# Altium schematic sheet AIM2 - FTDI REVB.SchDoc: FTDI USB to UART Interface
size B; DrawnBy: DJW; DocumentNumber: 4; SheetNumber: 4; SheetTotal: 12
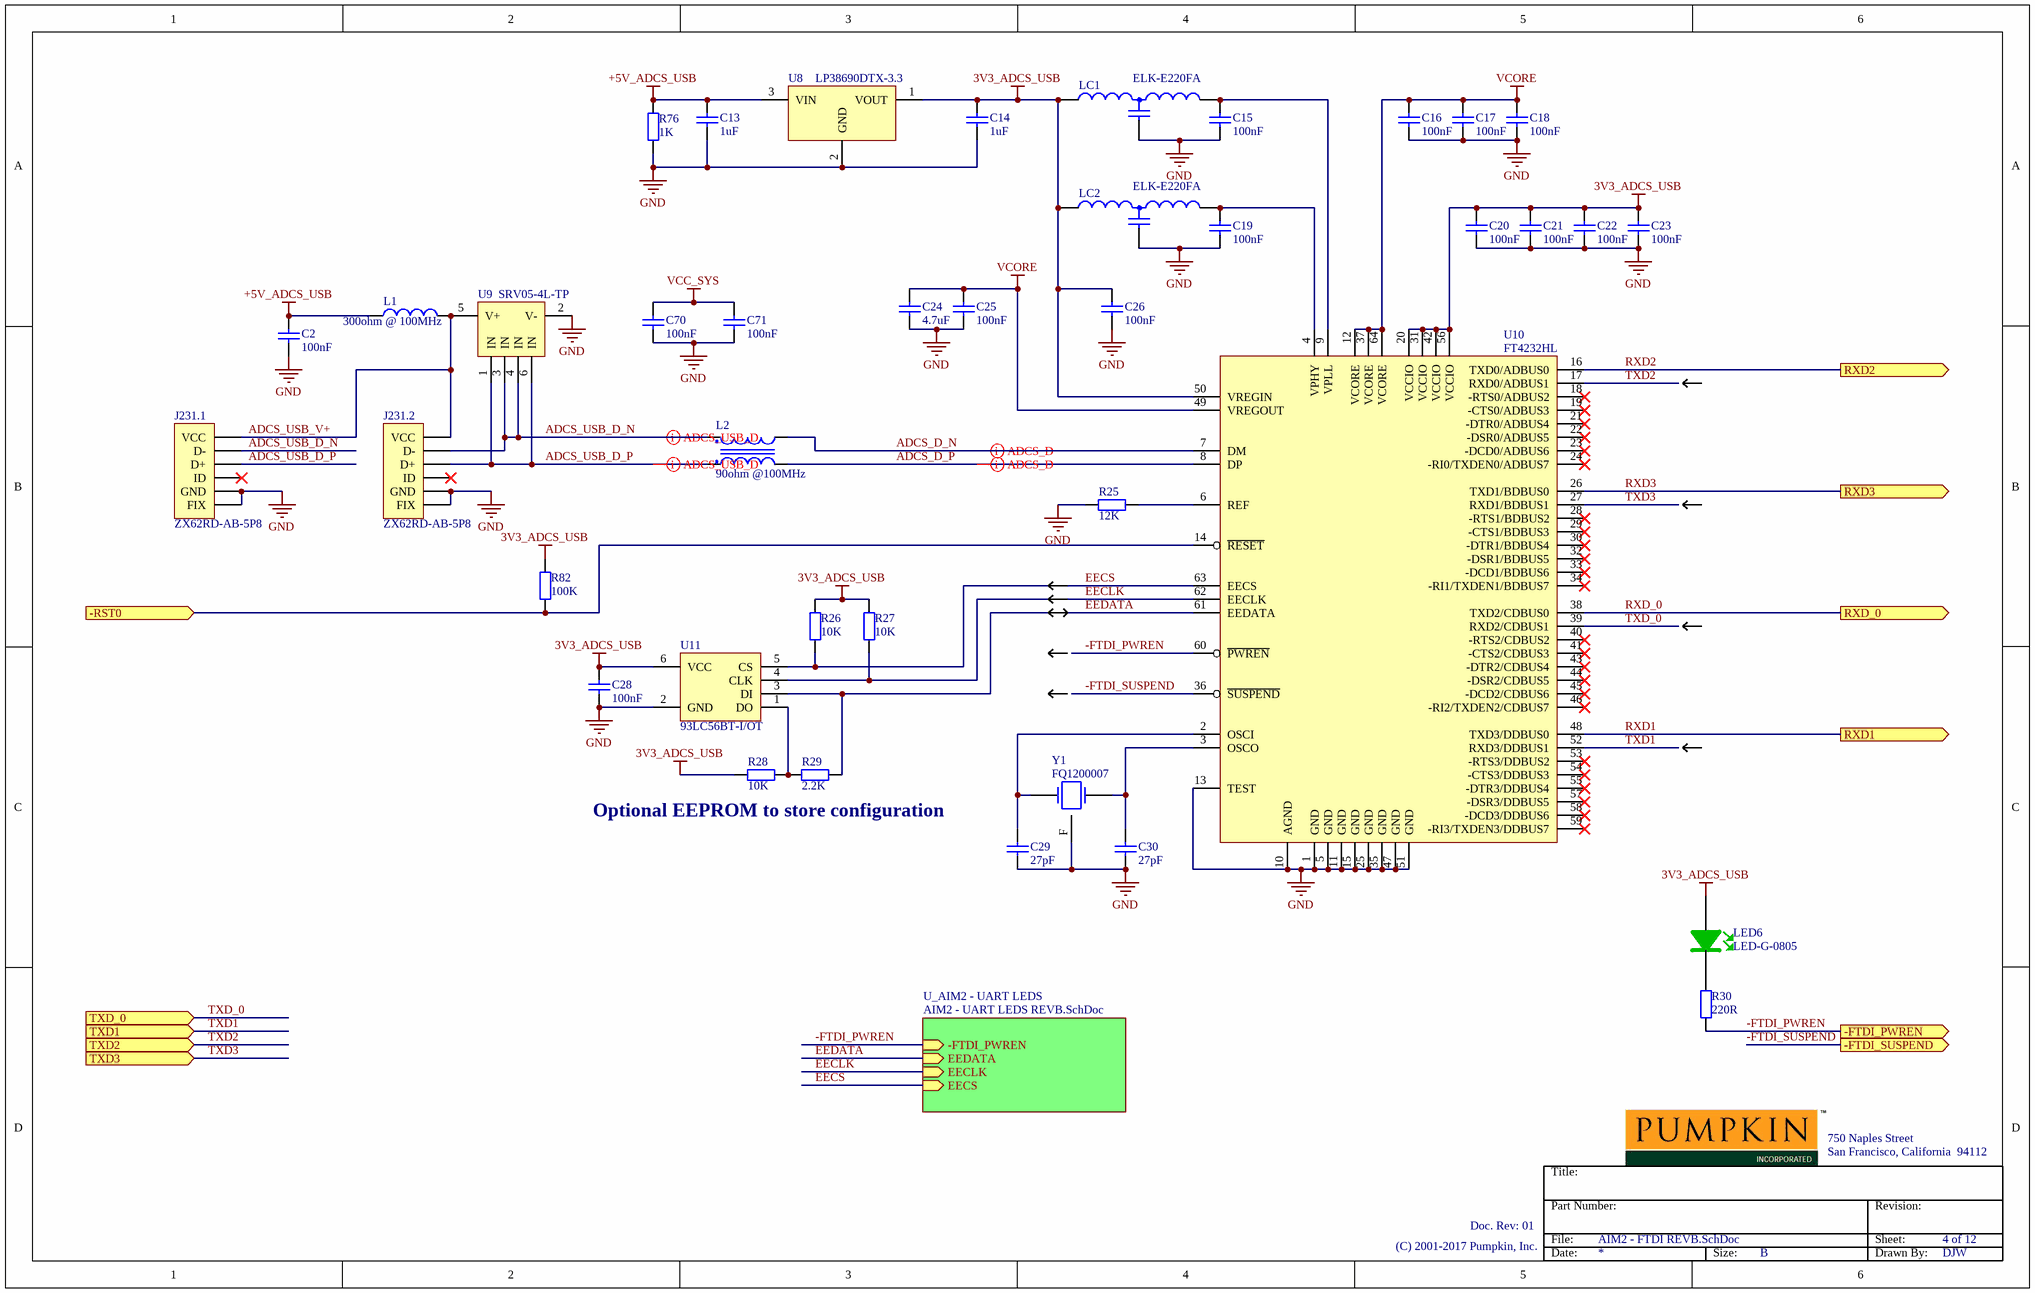
[diagram p0: AIM2 - FTDI REVB.SchDoc]

## Parts
C2  100nF  [0603 CAP]
C13  1uF  [0805 CAP]
C14  1uF  [0805 CAP]
C15  100nF  [0603 CAP]
C16  100nF  [0603 CAP]
C17  100nF  [0603 CAP]
C18  100nF  [0603 CAP]
C19  100nF  [0603 CAP]
C20  100nF  [0603 CAP]
C21  100nF  [0603 CAP]
C22  100nF  [0603 CAP]
C23  100nF  [0603 CAP]
C24  4.7uF  [0805 CAP]
C25  100nF  [0603 CAP]
C26  100nF  [0603 CAP]
C28  100nF  [0603 CAP]
C29  27pF  [0402 CAP]
C30  27pF  [0402 CAP]
C70  100nF  [0603 CAP]
C71  100nF  [0603 CAP]
J231.1  ZX62RD-AB-5P8  [SM$5C$ZX62RD-AB-5P8]
J231.2  ZX62RD-AB-5P8  [SM$5C$ZX62RD-AB-5P8]
L1  300ohm @ 100MHz  [0603 IND]
L2  90ohm @100MHz  [DFN250P320X200-4N]
LC1  ELK-E220FA  [ELK]
LC2  ELK-E220FA  [ELK]
LED6  LED-G-0805  [0805 LED-GREEN]
R25  12K  [0603 RES]
R26  10K  [0805 RES]
R27  10K  [0805 RES]
R28  10K  [0805 RES]
R29  2.2K  [0805 RES]
R30  220R  [0805 RES]
R76  1K  [0805 RES]
R82  100K  [0805 RES]
U8  LP38690DTX-3.3  [DPAK]
U9  SRV05-4L-TP  [SOT23-6]
U10  FT4232HL  [TSQFP50P1200X1200X120_HS-65N]
U11  93LC56BT-I/OT  [SOT23-6]
Y1  FQ1200007  [FQ Crystal]

## Sub-sheets
U_AIM2 - UART LEDS = AIM2 - UART LEDS REVB.SchDoc: -FTDI_PWREN (in), EEDATA (in), EECLK (in), EECS (in)

## Ports
-FTDI_PWREN (out), -FTDI_SUSPEND (out), -RST0 (in), RXD1 (out), RXD2 (out), RXD3 (out), RXD_0 (out), TXD1 (in), TXD2 (in), TXD3 (in), TXD_0 (in)

## Nets
3V3_ADCS_USB: C14.2 C20.2 C21.2 C22.2 C23.2 C26.2 C28.2 LC1.1 LC2.1 LED6.2 R26.2 R27.2 R28.1 R82.2 U8.1(VOUT) U10.20(VCCIO) U10.31(VCCIO) U10.42(VCCIO) U10.50(VREGIN) U10.56(VCCIO) U11.6(VCC)
+5V_ADCS_USB: C2.2 C13.2 L1.1 R76.2 U8.3(VIN)
GND: C2.1 C13.1 C14.1 C15.1 C16.1 C17.1 C18.1 C19.1 C20.1 C21.1 C22.1 C23.1 C24.1 C25.1 C26.1 C28.1 C29.1 C30.1 C70.1 C71.1 J231.1.5(GND) J231.1.F(FIX) J231.2.5(GND) J231.2.F(FIX) LC1.2 LC2.2 R25.1 R76.1 U8.2(GND) U9.2(V-) U10.1(GND) U10.5(GND) U10.10(AGND) U10.11(GND) U10.13(TEST) U10.15(GND) U10.25(GND) U10.35(GND) U10.47(GND) U10.51(GND) U11.2(GND) Y1.F
VCC_SYS: C70.2 C71.2
VCORE: C16.2 C17.2 C18.2 C24.2 C25.2 U10.12(VCORE) U10.37(VCORE) U10.49(VREGOUT) U10.64(VCORE)
-FTDI_PWREN: R30.1 U10.60(~{PWREN}) ; port -FTDI_PWREN, sheet U_AIM2 - UART LEDS/-FTDI_PWREN
-FTDI_SUSPEND: U10.36(~{SUSPEND}) ; port -FTDI_SUSPEND
-RST0: R82.1 U10.14(~{RESET}) ; port -RST0
ADCS_D_N: L2.3 U10.7(DM)
ADCS_D_P: L2.2 U10.8(DP)
ADCS_USB_D_N: J231.1.2(D-) J231.2.2(D-) L2.4 U9.3(IN) U9.4(IN)
ADCS_USB_D_P: J231.1.3(D+) J231.2.3(D+) L2.1 U9.1(IN) U9.6(IN)
ADCS_USB_V+: J231.1.1(VCC) J231.2.1(VCC) L1.2 U9.5(V+)
EECLK: R27.1 U10.62(EECLK) U11.4(CLK) ; sheet U_AIM2 - UART LEDS/EECLK
EECS: R26.1 U10.63(EECS) U11.5(CS) ; sheet U_AIM2 - UART LEDS/EECS
EEDATA: R29.2 U10.61(EEDATA) U11.3(DI) ; sheet U_AIM2 - UART LEDS/EEDATA
RXD1: U10.48(TXD3/DDBUS0) ; port RXD1
RXD2: U10.16(TXD0/ADBUS0) ; port RXD2
RXD3: U10.26(TXD1/BDBUS0) ; port RXD3
RXD_0: U10.38(TXD2/CDBUS0) ; port RXD_0
TXD1: U10.52(RXD3/DDBUS1) ; port TXD1
TXD2: U10.17(RXD0/ADBUS1) ; port TXD2
TXD3: U10.27(RXD1/BDBUS1) ; port TXD3
TXD_0: U10.39(RXD2/CDBUS1) ; port TXD_0
NetC15_2: C15.2 LC1.3 U10.9(VPLL)
NetC19_2: C19.2 LC2.3 U10.4(VPHY)
NetC29_2: C29.2 U10.2(OSCI) Y1.1
NetC30_2: C30.2 U10.3(OSCO) Y1.3
NetLED6_1: LED6.1 R30.2
NetR25_2: R25.2 U10.6(REF)
NetR28_2: R28.2 R29.1 U11.1(DO)

Not connected (* = marked no-connect by the designer): J231.1 4(ID)*; J231.2 4(ID)*; U10 18(-RTS0/ADBUS2)* 19(-CTS0/ADBUS3)* 21(-DTR0/ADBUS4)* 22(-DSR0/ADBUS5)* 23(-DCD0/ADBUS6)* 24(-RI0/TXDEN0/ADBUS7)* 28(-RTS1/BDBUS2)* 29(-CTS1/BDBUS3)* 30(-DTR1/BDBUS4)* 32(-DSR1/BDBUS5)* 33(-DCD1/BDBUS6)* 34(-RI1/TXDEN1/BDBUS7)* 40(-RTS2/CDBUS2)* 41(-CTS2/CDBUS3)* 43(-DTR2/CDBUS4)* 44(-DSR2/CDBUS5)* 45(-DCD2/CDBUS6)* 46(-RI2/TXDEN2/CDBUS7)* 53(-RTS3/DDBUS2)* 54(-CTS3/DDBUS3)* 55(-DTR3/DDBUS4)* 57(-DSR3/DDBUS5)* 58(-DCD3/DDBUS6)* 59(-RI3/TXDEN3/DDBUS7)*

## Layout directives
differential pair; rule Matched Net Lengths [Tolerance = 10mil]; net class Diff Pairs: ADCS_D_N, ADCS_D_P, ADCS_USB_D_N, ADCS_USB_D_P

## Notes on the sheet
- Optional EEPROM to store configuration
- Title:
- 750 Naples Street
- San Francisco, California  94112
- Doc. Rev: 01
- File:
- Part Number:
- Revision:
- Sheet:
- (C) 2001-2017 Pumpkin, Inc.
- Date:
- Size:
- B
- Drawn By:

## Library data of the parts
C2 C15-C23 C25 C26 C28 C70 C71 = Capacitor 100nF 0603: Capacitor 100nF 0603 X7R 50V 5%; Value: 100nF; Supplier 1: Digi-Key; Supplier Part Number 1: 399-7844-1-ND
C13 C14 = Capacitor 1uF 0805: Capacitor 1uF 0805 X7R 25V 10%; Value: 1uF; Supplier 1: Digi-Key; Supplier Part Number 1: 445-5687-1-ND
C24 = Capacitor 4.7uF 0805: Capacitor 4.7uF 0805 X7R 35V 10%; Value: 4.7uF; Supplier 1: Digi-Key; Supplier Part Number 1: 445-172479-1-ND
C29 C30 = Capacitor 27pF 0402: Capacitor 27pF 0402 NP0 50V 1%; Value: 27pF; Supplier 1: Digi-Key; Supplier Part Number 1: 490-6223-1-ND
J231.1 J231.2 = ZX62RD-AB-5P8: Header USB Micro AB; Supplier 1: Digi-Key; Supplier Part Number 1: H11611CT-ND
L1 = Ferrite Bead 300ohm @ 100MHz: Revision: July-2002: Re-released for DXP Platform.; Value: 300ohm @ 100MHz; Supplier 1: Digi-Key; Supplier Part Number 1: 732-1592-1-ND
L2 = Choke 90ohm @ 100MHz: Choke Common-mode 90ohm @ 100MHz; Supplier 1: Digi-Key; Supplier Part Number 1: 732-1469-1-ND
LC1 LC2 = LC Filter: Filter LC 100MHz; Supplier 1: Digi-Key; Supplier Part Number 1: P9871DKR-ND
LED6 = LED GREEN 0805: Supplier 1: Digi-Key; Supplier Part Number 1: 160-1414-1-ND
R25 = Resistor 12K 0603: Resistor 12K 0603 0.1W 1%; Revision: Altium ETH 11-03.2008; Value: 12K; Supplier 1: Digi-Key; Supplier Part Number 1: P12.0KHCT-ND
R26-R28 = Resistor 10K 0805: Resistor 10K 0805 0.125W 1%; Revision: Altium ETH 11-03.2008; Supplier 1: Digi-Key; Supplier Part Number 1: 311-10.0KCRCT-ND; Value: 10K
R29 = Resistor 2K2 0805: Resistor 2.2K 0805 0.125W 1%; Revision: Altium ETH 11-03.2008; Value: 2.2K; Supplier 1: Digi-Key; Supplier Part Number 1: 311-2.20KCRCT-ND
R30 = Resistor 220R 0805: Resistor 220R 0805 0.125W 1%; Revision: Altium ETH 11-03.2008; Value: 220R; Supplier 1: Digi-Key; Supplier Part Number 1: P220CCT-ND
R76 = Resistor 1K 0805: Resistor 1K 0805 0.125W 1%; Revision: Altium ETH 11-03.2008; Value: 1K; Supplier 1: Digi-Key; Supplier Part Number 1: P1.00KCCT-ND
R82 = Resistor 100K 0805: Resistor 100K 0805 0.5W 1%; Revision: Altium ETH 11-03.2008; Value: 100K; Supplier 1: Digi-Key; Supplier Part Number 1: P16060CT-ND
U8 = LP38690DTX-3.3: Regulator 3.3V LDO; Supplier 1: Digi-Key; Supplier Part Number 1: LP38690DTX-3.3/NOPBCT-ND
U9 = SRV05-4L-TP: IC ESD protection 4 input; Supplier 1: Digi-Key; Supplier Part Number 1: SRV05-4L-TPMSCT-ND
U10 = FT4232HL: IC FTDI 4 port controller; Supplier 1: Digi-Key; Supplier Part Number 1: 768-1026-1-ND
U11 = 93LC56BT-I/OT: IC Memory EEPROM 2Kbit; Supplier 1: Digi-Key; Supplier Part Number 1: 93LC56BT-I/OTCT-ND
Y1 = FQ1200007: Crystal 12MHz; Supplier 1: Digi-Key; Supplier Part Number 1: FQ1200007CT-ND